# EAGLE design pcb_poinsettia (EAGLE 9.5.2)
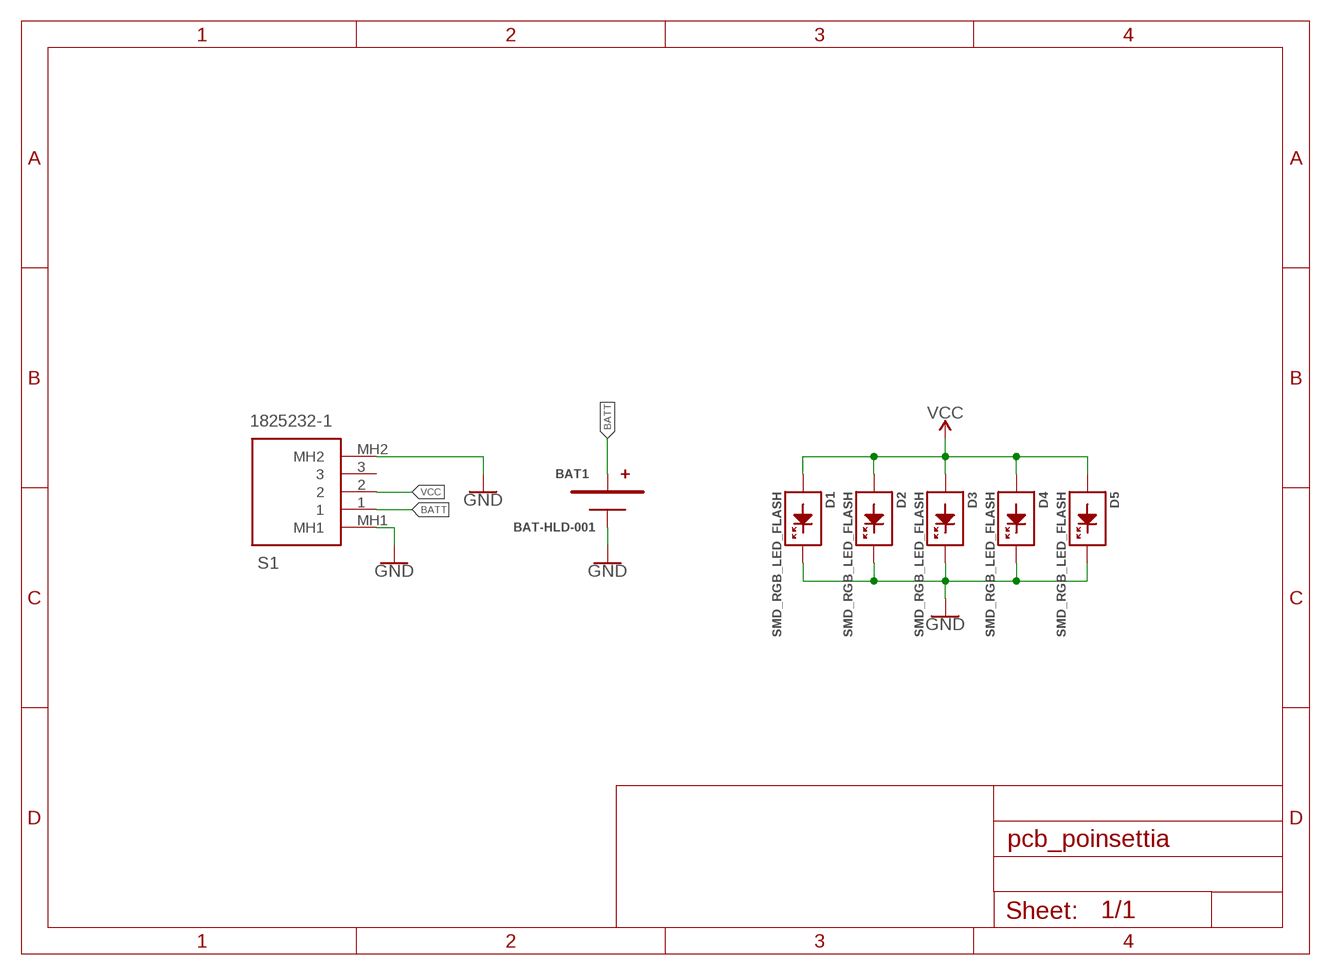
[diagram p0: schematic, sheet 1]

## Parts
BAT1  BAT-HLD-001  [BATHLD001]
D1  SMD_RGB_LED_FLASH  [SMD_RGB_LED_0807]
D2  SMD_RGB_LED_FLASH  [SMD_RGB_LED_0807]
D3  SMD_RGB_LED_FLASH  [SMD_RGB_LED_0807]
D4  SMD_RGB_LED_FLASH  [SMD_RGB_LED_0807]
D5  SMD_RGB_LED_FLASH  [SMD_RGB_LED_0807]
S1  1825232-1  [18252321]

## Nets
BATT: BAT1.1(P) BAT1.2(P) S1.1
GND: BAT1.3(N) D1.3(K) D1.4(K) D2.3(K) D2.4(K) D3.3(K) D3.4(K) D4.3(K) D4.4(K) D5.3(K) D5.4(K) S1.MH1 S1.MH2
VCC: D1.1(A) D1.2(A) D2.1(A) D2.2(A) D3.1(A) D3.2(A) D4.1(A) D4.2(A) D5.1(A) D5.2(A) S1.2
Unconnected: S1.3

## Library data of the parts
BAT1 = FL-Battery:BAT-HLD-001: Soporte para baterías de botón Linx CR2032 Battery Holder, Tape n Reel; DATASHEET: https://www.mouser.mx/datasheet/2/238/bat_hld_001-1659379.pdf; LCSC#PART: -; MANUFACTURER#PART: BAT-HLD-001-TR; MANUFACTURER_NAME: Linx Technologies; MOUSER#PART: 712-BAT-HLD-001-TR; PACKAGE: SMD
D1-D5 = FL-Led:SMD_RGB_LED_FLASH: 0807 RGB Led Lamp SMD, RGB Slow Flashing Diode, Colorful Diodes, DIY Flash; DATASHEET: https://es.aliexpress.com/item/32829140495.html?spm=a2g0s.9042311.0.0.32vRd6; LCSC#PART: -; MANUFACTURER#PART: -; MANUFACTURER_NAME: -; MOUSER#PART: -; PACKAGE: 0807
S1 = 1825232-1:1825232-1: TE CONNECTIVITY - 1825232-1 - SLIDE SWITCH, SPDT, 0.2A, 30VDC, SOLDER Source: Datasheet; ARROW_PART_NUMBER: 1825232-1; ARROW_PRICE-STOCK: https://www.arrow.com/en/products/1825232-1/te-connectivity; DESCRIPTION: TE CONNECTIVITY - 1825232-1 - SLIDE SWITCH, SPDT, 0.2A, 30VDC, SOLDER; HEIGHT: 3.7mm; MANUFACTURER_NAME: TE Connectivity; MANUFACTURER_PART_NUMBER: 1825232-1; MOUSER_PART_NUMBER: 655-1825232-1; MOUSER_PRICE-STOCK: https://www.mouser.co.uk/ProductDetail/TE-Connectivity-PB/1825232-1?qs=kTKVN3NWb5FosGxaNC1%252BtA%3D%3D

## Board
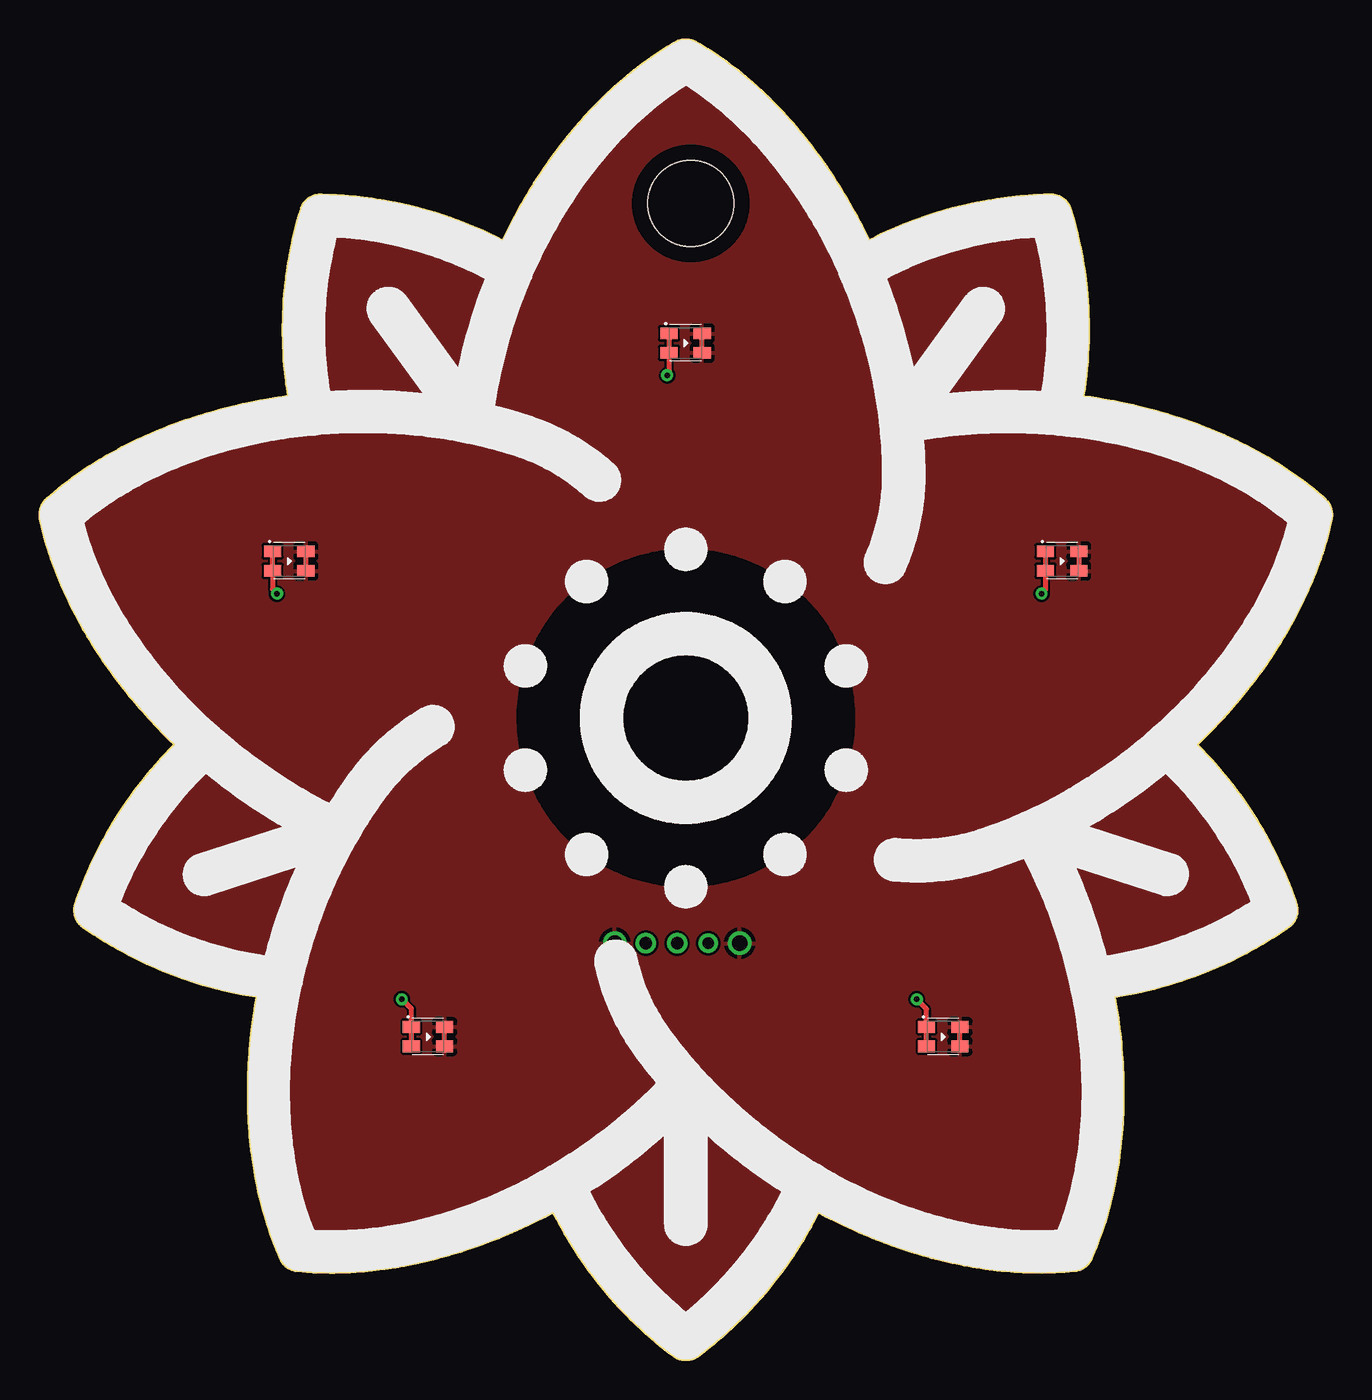
[diagram p1: board, top side]
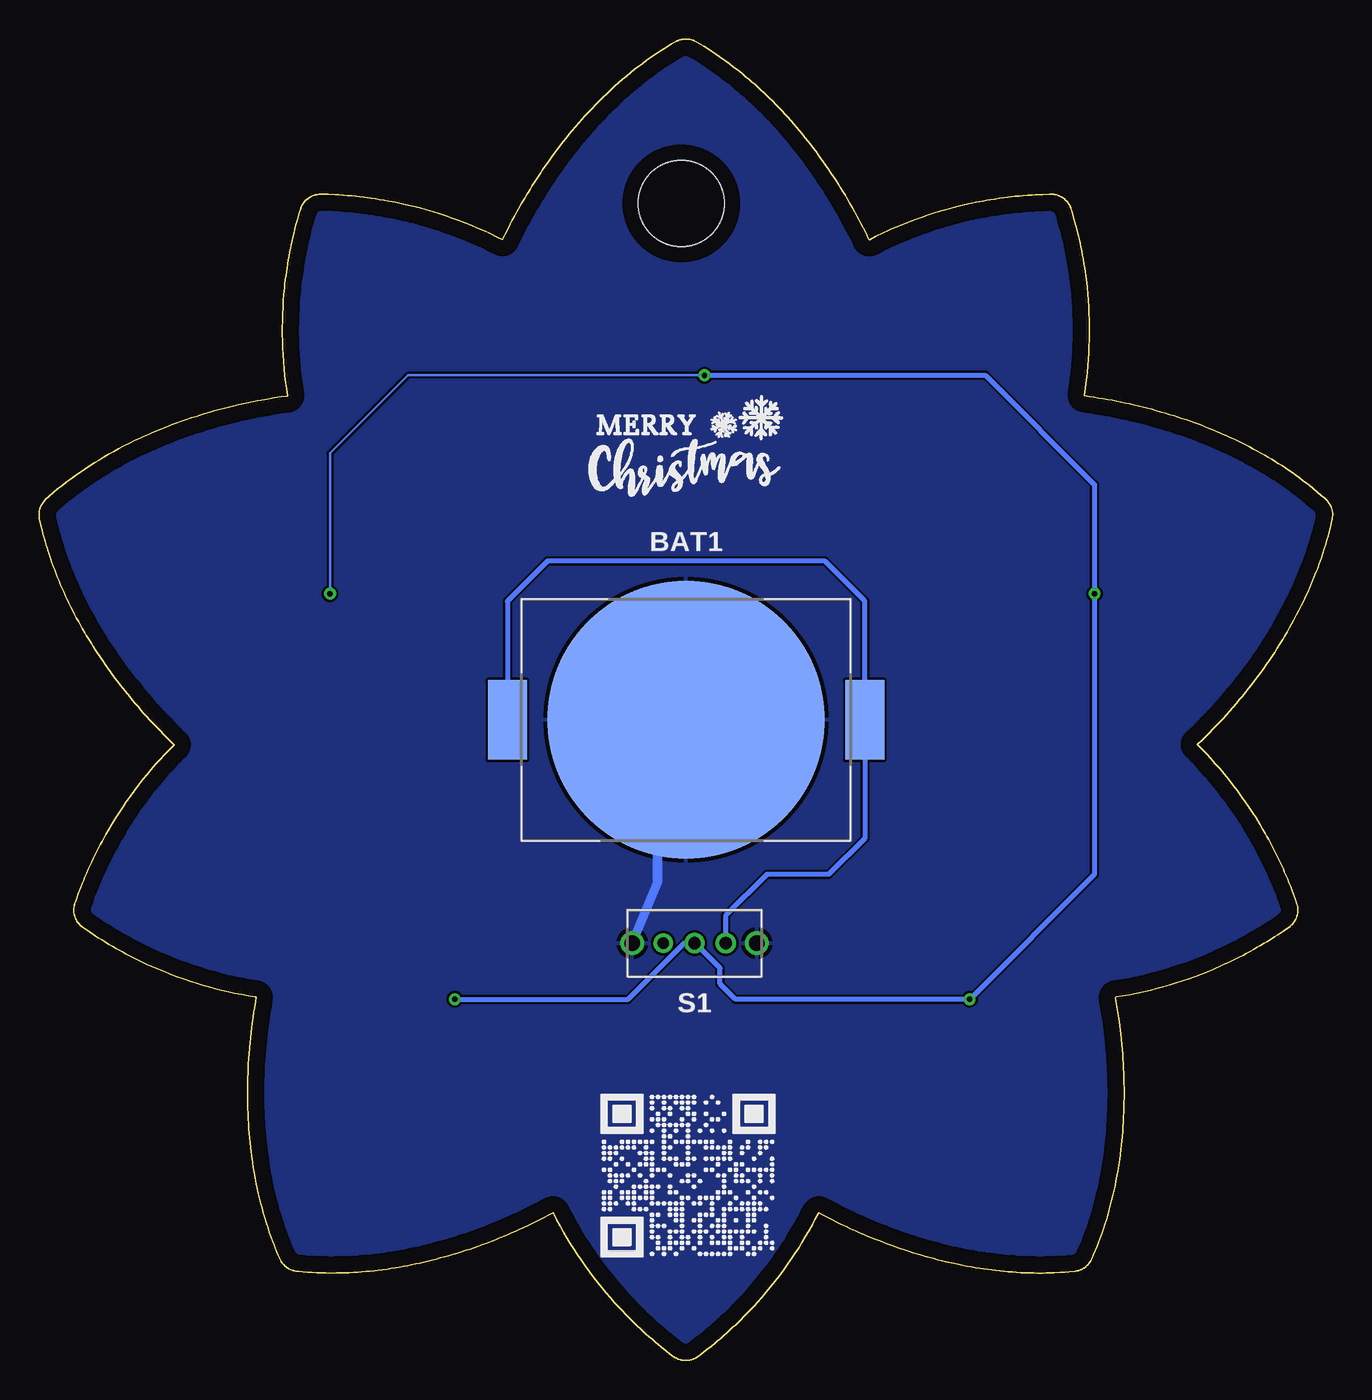
[diagram p2: board, bottom side, seen from below]

Size 82.91 x 84.7 mm. Coordinates in mm from the lower left corner, seen from the top.
Outline: 1193 segments
Copper layers (1*16): Top 0.035mm / dielectric 1.5mm / Bottom 0.035mm
Design rules "default": minimum track width 6mil, minimum drill 0.35mm, track to track 6mil, track to pad 6mil, pad to pad 6mil, via to via 6mil, smd to smd 6mil, copper to edge 40mil, drill to drill 6mil, minimum pad ring 10mil, minimum via ring 8mil, stop-mask expansion 4mil, vias tented up to drill 0mil, thermal gap 10mil
Holes 5.5 mm at 41.76,74.15
tRestrict: area 30.6,30.4 to 52.3,52

### Footprints (pad centres in the part's own frame; a part is rotated, then mirrored left to right if it is on the bottom)
BATHLD001 = smd 2.5 x 5.1: 1 11.45,0; 2 -11.45,0 | smd 17.8 x 17.8: 3 0,0
SMD_RGB_LED_0807 = smd 1.1 x 0.75: 1 1.065,-0.635; 2 1.065,0.61; 3 -1.068,0.61; 4 -1.068,-0.635
18252321 = drill 0.8 pad 1.3: 1 0,0; 2 2,0 | drill 0.75 pad 1.2: 3 4,0 | drill 1 pad 1.5: MH1 -2,0; MH2 6,0

### Placement (x,y rotation side)
BAT1  41.44,41.06 0 bottom
D1  16.04,51.22 180 top
D2  41.44,65.19 180 top
D3  65.57,51.22 180 top
D4  57.95,20.74 180 top
D5  24.93,20.74 180 top
S1  38.9,26.74 180 bottom

### Tracks (layer width: path | path; a pad name or v marks a point on that pad's centre or on a via)
BATT
  Bottom 0.305: S1.1 38.9,28.51 36.26,31.15 32.3,31.15 29.99,33.46 BAT1.1 29.99,48.66 32.55,51.22 50.33,51.22 52.89,48.66 BAT1.2
GND
  Top 0.305: D5.3 D5.4 | D4.3 D4.4 | D3.4 D3.3 | D2.3 D2.4 | D1.3 D1.4
  Bottom 0.61: BAT1.3 43.26,38.65 43.26,30.65 S1.MH2
  pour Top (rank 3): 731 corners
  pour Top (rank 3): 64.28,62.1 64.33,62.38 64.38,62.71 64.42,63.05 64.46,63.33 64.49,63.66 64.52,63.94 64.55,64.28 64.57,64.56 64.59,64.9 64.6,65.18 64.61,65.52 64.61,65.81 64.62,66.14 64.61,66.43 64.6,66.77 64.59,67.05 64.58,67.39 64.56,67.67 64.54,68.01 64.51,68.29 64.48,68.62 64.44,68.96 64.4,69.24 64.35,69.58 64.31,69.85 64.25,70.19 64.2,70.47 64.14,70.8 64.08,71.07 64,71.41 63.91,71.79 63.87,71.95 63.85,72.01 63.52,71.98 63.23,71.96 62.9,71.93 62.62,71.9 62.28,71.86 62,71.82 61.66,71.77 61.39,71.73 61.05,71.67 60.77,71.62 60.44,71.55 60.17,71.49 59.84,71.42 59.56,71.35 59.23,71.27 58.91,71.18 58.58,71.08 58.26,70.99 57.99,70.9 57.67,70.79 57.4,70.7 57.08,70.59 56.76,70.47 56.5,70.36 56.19,70.24 55.93,70.13 55.62,69.99 55.36,69.87 55.05,69.73 54.75,69.58 54.35,69.38 54.3,69.35 54.45,68.98 54.57,68.66 54.7,68.29 54.83,67.92 54.94,67.6 55.06,67.22 55.18,66.84 55.3,66.47 55.4,66.14 55.5,65.76 55.61,65.38 55.69,65.05 55.79,64.67 55.88,64.28 55.97,63.9 56.04,63.57 56.07,63.59 59.42,68.2 59.49,68.29 59.53,68.34 59.57,68.38 59.61,68.42 59.65,68.45 59.69,68.49 59.74,68.52 59.79,68.55 59.83,68.58 59.88,68.61 59.93,68.64 59.98,68.66 60.04,68.68 60.09,68.7 60.14,68.72 60.2,68.73 60.25,68.75 60.31,68.76 60.36,68.76 60.42,68.77 60.48,68.77 60.53,68.77 60.59,68.77 60.65,68.77 60.7,68.76 60.76,68.75 60.81,68.74 60.87,68.73 60.92,68.71 60.98,68.7 61.03,68.68 61.08,68.65 61.13,68.63 61.18,68.6 61.23,68.57 61.28,68.54 61.32,68.51 61.37,68.48 61.41,68.44 61.45,68.4 61.49,68.36 61.53,68.32 61.57,68.28 61.6,68.24 61.64,68.19 61.67,68.14 61.7,68.09 61.72,68.04 61.75,67.99 61.77,67.94 61.79,67.89 61.81,67.84 61.83,67.78 61.84,67.73 61.85,67.67 61.86,67.62 61.87,67.56 61.87,67.5 61.88,67.45 61.88,67.39 61.87,67.33 61.87,67.28 61.86,67.22 61.85,67.17 61.84,67.11 61.83,67.06 61.81,67 61.79,66.95 61.77,66.9 61.75,66.85 61.72,66.79 61.69,66.75 61.66,66.7 61.6,66.6 58.25,61.99 58.24,61.96 58.58,61.99 58.97,62.03 59.37,62.06 59.76,62.09 60.1,62.11 60.49,62.13 60.89,62.14 61.23,62.15 61.62,62.16 62.02,62.16 62.41,62.16 62.75,62.16 63.15,62.15 63.54,62.13 63.88,62.12 64.28,62.09
  pour Top (rank 3): 28.57,69.37 28.27,69.53 28.02,69.65 27.71,69.8 27.45,69.92 27.15,70.06 26.89,70.17 26.63,70.28 26.31,70.4 26.05,70.5 25.73,70.62 25.46,70.72 25.14,70.83 24.88,70.92 24.55,71.02 24.28,71.1 23.96,71.19 23.68,71.26 23.36,71.35 23.08,71.42 22.75,71.49 22.48,71.55 22.14,71.62 21.87,71.67 21.53,71.73 21.25,71.77 20.92,71.82 20.64,71.86 20.3,71.9 20.02,71.93 19.68,71.96 19.35,71.99 19.06,72.01 19.04,71.96 18.95,71.58 18.87,71.25 18.79,70.86 18.73,70.58 18.67,70.25 18.61,69.92 18.57,69.64 18.52,69.3 18.48,69.02 18.44,68.68 18.41,68.4 18.38,68.07 18.36,67.79 18.34,67.45 18.32,67.11 18.31,66.77 18.3,66.43 18.3,66.15 18.3,65.81 18.3,65.53 18.31,65.19 18.32,64.91 18.34,64.57 18.36,64.29 18.39,63.95 18.42,63.67 18.45,63.33 18.49,63.05 18.53,62.72 18.58,62.44 18.63,62.1 18.68,62.1 19.08,62.12 19.47,62.14 19.81,62.15 20.15,62.16 20.55,62.17 20.88,62.17 21.28,62.17 21.67,62.16 22.01,62.15 22.41,62.13 22.8,62.12 23.2,62.09 23.54,62.07 23.93,62.04 24.32,62 24.66,61.97 24.66,61.99 21.28,66.65 21.24,66.7 21.22,66.75 21.19,66.8 21.16,66.85 21.14,66.9 21.12,66.95 21.1,67.01 21.09,67.06 21.07,67.12 21.06,67.17 21.05,67.23 21.04,67.28 21.04,67.34 21.04,67.4 21.04,67.45 21.04,67.51 21.04,67.56 21.05,67.62 21.06,67.68 21.07,67.73 21.09,67.79 21.1,67.84 21.12,67.89 21.14,67.95 21.16,68 21.19,68.05 21.22,68.1 21.25,68.15 21.28,68.19 21.31,68.24 21.35,68.28 21.38,68.33 21.42,68.37 21.46,68.41 21.5,68.44 21.55,68.48 21.59,68.51 21.64,68.55 21.69,68.58 21.73,68.61 21.78,68.63 21.84,68.66 21.89,68.68 21.94,68.7 21.99,68.72 22.05,68.73 22.1,68.74 22.16,68.75 22.21,68.76 22.27,68.77 22.33,68.77 22.38,68.77 22.44,68.77 22.5,68.77 22.55,68.76 22.61,68.76 22.66,68.75 22.72,68.73 22.77,68.72 22.83,68.7 22.88,68.68 22.93,68.66 22.98,68.64 23.03,68.61 23.08,68.58 23.13,68.55 23.18,68.52 23.22,68.49 23.27,68.45 23.31,68.41 23.35,68.37 23.39,68.33 23.42,68.29 23.49,68.2 26.85,63.59 26.88,63.56 26.96,63.94 27.03,64.27 27.13,64.66 27.22,65.04 27.32,65.42 27.41,65.75 27.52,66.13 27.63,66.51 27.73,66.83 27.85,67.21 27.97,67.59 28.1,67.96 28.21,68.28 28.35,68.65 28.49,69.02 28.61,69.34
  pour Top (rank 3): 10.66,37.64 10.42,37.4 10.23,37.2 10.03,37 9.8,36.75 9.61,36.54 9.39,36.28 9.2,36.07 8.98,35.81 8.81,35.59 8.6,35.33 8.42,35.1 8.22,34.83 8.05,34.6 7.86,34.33 7.7,34.09 7.51,33.81 7.35,33.58 7.17,33.29 7.02,33.05 6.85,32.76 6.71,32.52 6.54,32.22 6.41,31.97 6.25,31.67 6.12,31.42 5.97,31.12 5.82,30.81 5.7,30.56 5.57,30.25 5.45,29.99 5.32,29.68 5.22,29.41 5.25,29.38 5.44,29.26 5.78,29.05 6.12,28.85 6.41,28.68 6.71,28.52 7.01,28.36 7.31,28.21 7.62,28.06 7.87,27.94 8.18,27.79 8.44,27.68 8.75,27.54 9.01,27.44 9.32,27.31 9.64,27.19 9.96,27.07 10.28,26.96 10.54,26.87 10.87,26.77 11.14,26.68 11.46,26.59 11.73,26.51 12.06,26.43 12.39,26.34 12.66,26.28 12.94,26.22 13.27,26.15 13.6,26.08 13.88,26.03 14.22,25.98 14.5,25.94 14.52,25.98 14.62,26.36 14.72,26.74 14.83,27.12 14.93,27.45 15.03,27.77 15.13,28.09 15.24,28.41 15.35,28.74 15.46,29.05 15.58,29.37 15.68,29.64 15.8,29.95 15.96,30.37 16.13,30.79 16.31,31.21 16.49,31.62 16.47,31.64 11,29.86 10.94,29.84 10.89,29.83 10.83,29.82 10.78,29.81 10.72,29.81 10.66,29.8 10.61,29.8 10.55,29.8 10.49,29.81 10.44,29.81 10.38,29.82 10.33,29.83 10.27,29.84 10.22,29.86 10.16,29.87 10.11,29.89 10.06,29.92 10.01,29.94 9.96,29.97 9.91,29.99 9.86,30.02 9.81,30.06 9.77,30.09 9.73,30.13 9.68,30.16 9.64,30.2 9.6,30.24 9.57,30.29 9.53,30.33 9.5,30.38 9.47,30.42 9.44,30.47 9.41,30.52 9.38,30.57 9.36,30.62 9.34,30.67 9.32,30.73 9.3,30.78 9.29,30.84 9.28,30.89 9.27,30.95 9.26,31 9.26,31.06 9.25,31.12 9.25,31.17 9.25,31.23 9.26,31.28 9.26,31.34 9.27,31.4 9.29,31.45 9.3,31.51 9.31,31.56 9.33,31.61 9.35,31.67 9.38,31.72 9.4,31.77 9.43,31.82 9.46,31.87 9.49,31.91 9.52,31.96 9.55,32.01 9.59,32.05 9.63,32.09 9.67,32.13 9.71,32.17 9.75,32.2 9.8,32.24 9.84,32.27 9.89,32.3 9.94,32.33 9.99,32.36 10.04,32.38 10.09,32.4 10.15,32.42 10.2,32.44 15.62,34.2 15.66,34.22 15.32,34.42 15.03,34.6 14.69,34.8 14.36,35.01 14.03,35.23 13.74,35.41 13.41,35.63 13.09,35.86 12.81,36.05 12.49,36.28 12.17,36.51 11.9,36.72 11.59,36.96 11.28,37.2 10.97,37.45 10.7,37.66
  pour Top (rank 3): 35.31,10.8 35.46,10.5 35.59,10.25 35.75,9.95 35.89,9.7 36.03,9.46 36.2,9.16 36.35,8.92 36.53,8.64 36.68,8.4 36.87,8.12 37.03,7.88 37.22,7.61 37.39,7.38 37.59,7.11 37.76,6.88 37.97,6.61 38.15,6.39 38.36,6.13 38.54,5.92 38.77,5.66 38.96,5.45 39.19,5.2 39.38,5 39.61,4.75 39.81,4.55 40.06,4.32 40.26,4.12 40.51,3.89 40.76,3.67 40.97,3.48 41.23,3.26 41.45,3.08 41.49,3.1 41.66,3.24 41.96,3.5 42.26,3.76 42.51,3.99 42.76,4.22 43,4.46 43.24,4.7 43.48,4.94 43.67,5.14 43.9,5.39 44.09,5.6 44.31,5.86 44.5,6.07 44.71,6.33 44.93,6.59 45.14,6.86 45.34,7.13 45.51,7.36 45.71,7.63 45.87,7.86 46.06,8.14 46.22,8.38 46.4,8.66 46.55,8.9 46.73,9.19 46.9,9.48 47.04,9.73 47.2,10.02 47.34,10.27 47.49,10.57 47.62,10.83 47.58,10.86 47.3,11.04 46.97,11.26 46.64,11.48 46.27,11.74 45.9,12 45.67,12.17 45.36,12.4 45.09,12.6 44.82,12.81 44.55,13.02 44.24,13.27 43.94,13.52 43.68,13.74 43.38,13.99 43.08,14.25 42.83,14.48 42.81,14.46 42.81,8.7 42.8,8.65 42.8,8.59 42.79,8.53 42.78,8.48 42.77,8.42 42.76,8.37 42.74,8.31 42.72,8.26 42.7,8.21 42.68,8.16 42.65,8.11 42.62,8.06 42.6,8.01 42.56,7.96 42.53,7.92 42.49,7.87 42.46,7.83 42.42,7.79 42.38,7.75 42.34,7.71 42.29,7.68 42.25,7.64 42.2,7.61 42.15,7.58 42.11,7.55 42.05,7.53 42,7.5 41.95,7.48 41.9,7.46 41.85,7.44 41.79,7.43 41.74,7.41 41.68,7.4 41.62,7.4 41.57,7.39 41.51,7.39 41.46,7.39 41.4,7.39 41.34,7.39 41.29,7.4 41.23,7.4 41.17,7.41 41.12,7.43 41.07,7.44 41.01,7.46 40.96,7.48 40.91,7.5 40.86,7.53 40.81,7.55 40.76,7.58 40.71,7.61 40.66,7.64 40.62,7.68 40.57,7.71 40.53,7.75 40.49,7.79 40.45,7.83 40.42,7.87 40.38,7.92 40.35,7.96 40.32,8.01 40.29,8.06 40.26,8.11 40.23,8.16 40.21,8.21 40.19,8.26 40.17,8.32 40.16,8.37 40.14,8.42 40.13,8.48 40.12,8.54 40.11,8.59 40.11,8.65 40.1,8.76 40.1,14.46 40.09,14.49 39.84,14.26 39.54,14 39.24,13.75 38.94,13.49 38.68,13.28 38.37,13.03 38.06,12.79 37.79,12.58 37.47,12.34 37.15,12.11 36.83,11.88 36.55,11.68 36.23,11.46 35.9,11.24 35.57,11.02 35.29,10.84
  pour Top (rank 3): 68.46,25.94 68.79,25.99 69.07,26.04 69.4,26.1 69.68,26.16 70.01,26.23 70.29,26.29 70.62,26.37 70.89,26.44 71.16,26.51 71.49,26.6 71.76,26.68 72.08,26.78 72.35,26.87 72.67,26.97 72.94,27.07 73.26,27.18 73.52,27.28 73.84,27.41 74.1,27.52 74.41,27.65 74.67,27.76 74.98,27.9 75.23,28.03 75.54,28.18 75.79,28.3 76.09,28.46 76.34,28.59 76.63,28.76 76.88,28.9 77.17,29.07 77.46,29.25 77.7,29.4 77.68,29.45 77.64,29.56 77.49,29.92 77.38,30.18 77.24,30.49 77.12,30.75 76.98,31.05 76.83,31.36 76.67,31.66 76.51,31.96 76.38,32.21 76.21,32.5 76.07,32.75 75.9,33.04 75.75,33.28 75.57,33.56 75.38,33.85 75.22,34.08 75.03,34.36 74.87,34.59 74.67,34.86 74.5,35.09 74.29,35.36 74.12,35.58 73.9,35.84 73.72,36.06 73.5,36.31 73.31,36.53 73.09,36.78 72.85,37.02 72.62,37.27 72.34,37.55 72.26,37.63 72.22,37.67 71.91,37.42 71.65,37.2 71.34,36.96 71.02,36.72 70.75,36.52 70.43,36.28 70.11,36.05 69.79,35.83 69.51,35.63 69.18,35.41 68.85,35.2 68.52,34.98 68.23,34.8 67.89,34.6 67.56,34.39 67.26,34.22 67.29,34.2 72.72,32.44 72.77,32.42 72.82,32.4 72.87,32.38 72.92,32.36 72.97,32.33 73.02,32.3 73.07,32.27 73.12,32.24 73.16,32.2 73.2,32.17 73.25,32.13 73.29,32.09 73.32,32.05 73.36,32 73.39,31.96 73.43,31.91 73.46,31.86 73.49,31.82 73.51,31.77 73.54,31.72 73.56,31.66 73.58,31.61 73.6,31.56 73.61,31.5 73.63,31.45 73.64,31.39 73.65,31.34 73.65,31.28 73.66,31.22 73.66,31.17 73.66,31.11 73.66,31.06 73.65,31 73.64,30.94 73.63,30.89 73.62,30.83 73.61,30.78 73.59,30.72 73.57,30.67 73.55,30.62 73.53,30.57 73.5,30.52 73.47,30.47 73.44,30.42 73.41,30.37 73.38,30.33 73.34,30.28 73.31,30.24 73.27,30.2 73.23,30.16 73.19,30.12 73.14,30.09 73.1,30.05 73.05,30.02 73,29.99 72.95,29.96 72.9,29.94 72.85,29.91 72.8,29.89 72.75,29.87 72.69,29.86 72.64,29.84 72.58,29.83 72.53,29.82 72.47,29.81 72.42,29.81 72.36,29.8 72.3,29.8 72.25,29.8 72.19,29.81 72.13,29.81 72.08,29.82 72.02,29.83 71.97,29.85 71.86,29.88 66.44,31.64 66.41,31.63 66.55,31.32 66.7,30.96 66.86,30.59 66.98,30.28 67.13,29.91 67.27,29.54 67.4,29.17 67.52,28.85 67.64,28.48 67.77,28.1 67.89,27.72 67.99,27.4 68.1,27.02 68.21,26.64 68.3,26.32 68.4,25.93
  pour Bottom (rank 3): 1193 corners
VCC  (via drill 0.35 pad 0.55)
  Top 0.305: D1.1 D1.2 14.98,49.44 v15.26,49.15 | D2.1 D2.2 40.38,63.27 v40.26,63.15 | D3.1 D3.2 64.51,49.4 v64.26,49.15 | D4.2 D4.1 56.89,22.53 v56.26,23.15 | D5.2 D5.1 23.87,22.55 v23.26,23.15
  Bottom 0.152: v40.26,63.15 59.26,63.15 64.26,58.15 v64.26,49.15
  Bottom 0.305: v40.26,63.15 22.26,63.15 15.26,56.15 v15.26,49.15 15.26,31.15 v23.26,23.15 38.26,23.15 39.26,24.15 39.26,25.15 40.85,26.74 S1.2 41.58,26.74 45.17,23.15 v56.26,23.15